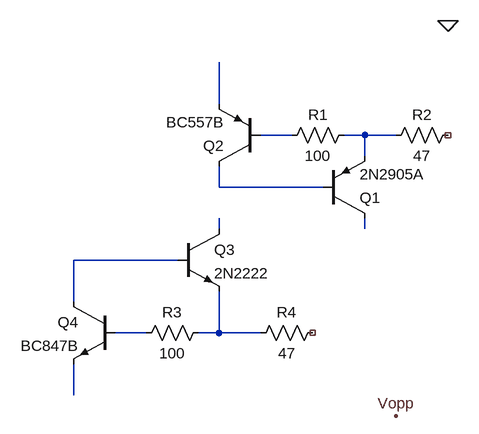
[diagram p0: schematic Draft1.asc]
Draft1.asc, the LTspice schematic file:
Version 4
SHEET 1 880 680
WIRE -93088 -3680 -93088 -3744
WIRE -92976 -3632 -93024 -3632
WIRE -92864 -3632 -92896 -3632
WIRE -92816 -3632 -92864 -3632
WIRE -92864 -3600 -92864 -3632
WIRE -93088 -3552 -93088 -3584
WIRE -92928 -3552 -93088 -3552
WIRE -93088 -3488 -93088 -3504
WIRE -92864 -3488 -92864 -3504
WIRE -93152 -3440 -93312 -3440
WIRE -93312 -3376 -93312 -3440
WIRE -93200 -3328 -93248 -3328
WIRE -93088 -3328 -93088 -3392
WIRE -93088 -3328 -93120 -3328
WIRE -93024 -3328 -93088 -3328
WIRE -93312 -3232 -93312 -3280
FLAG -92736 -3808 0
FLAG -92816 -3200 Vopp
SYMBOL pnp -92928 -3504 M180
SYMATTR InstName Q1
SYMATTR Value 2N2905A
SYMBOL pnp -93024 -3584 R180
SYMATTR InstName Q2
SYMATTR Value BC557B
SYMBOL res -92992 -3616 R270
WINDOW 0 32 56 VTop 2
WINDOW 3 0 56 VBottom 2
SYMATTR InstName R1
SYMATTR Value 100
SYMBOL res -92832 -3616 R270
WINDOW 0 32 56 VTop 2
WINDOW 3 0 56 VBottom 2
SYMATTR InstName R2
SYMATTR Value 47
SYMBOL npn -93152 -3488 R0
SYMATTR InstName Q3
SYMATTR Value 2N2222
SYMBOL npn -93248 -3376 M0
SYMATTR InstName Q4
SYMATTR Value BC847B
SYMBOL res -93104 -3344 R90
WINDOW 0 0 56 VBottom 2
WINDOW 3 32 56 VTop 2
SYMATTR InstName R3
SYMATTR Value 100
SYMBOL res -92928 -3344 R90
WINDOW 0 0 56 VBottom 2
WINDOW 3 32 56 VTop 2
SYMATTR InstName R4
SYMATTR Value 47

The netlist it stands for:
* Draft1.asc
Q1 N006 N004 N003 0 2N2905A
Q2 N004 N002 N001 0 BC557B
R1 N002 N003 100
R2 N003 NC_01 47
Q3 N005 N007 N009 0 2N2222
Q4 N007 N008 N010 0 BC847B
R3 N009 N008 100
R4 NC_02 N009 47
.model NPN NPN
.model PNP PNP
.lib standard.bjt
.backanno
.end